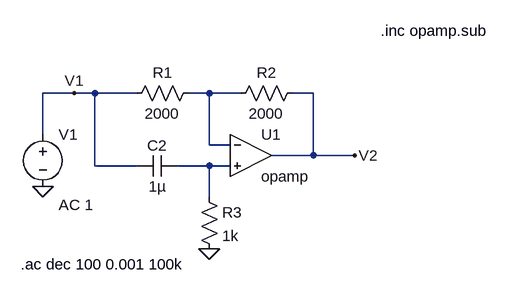
[diagram p0: schematic Circuito LTspice.asc]
Circuito LTspice.asc, the LTspice schematic file:
Version 4
SHEET 1 880 680
WIRE -80 80 -128 80
WIRE -48 80 -80 80
WIRE 16 80 -48 80
WIRE 128 80 96 80
WIRE 176 80 128 80
WIRE 288 80 256 80
WIRE -128 144 -128 80
WIRE 128 160 128 80
WIRE 160 160 128 160
WIRE 288 176 288 80
WIRE 288 176 224 176
WIRE 352 176 288 176
WIRE -48 192 -48 80
WIRE 16 192 -48 192
WIRE 128 192 80 192
WIRE 160 192 128 192
WIRE 128 240 128 192
FLAG 128 320 0
FLAG 352 176 V2
FLAG -80 80 V1
FLAG -128 224 0
SYMBOL OpAmps\\opamp 192 112 R0
SYMATTR InstName U1
SYMBOL res 112 64 R90
WINDOW 0 0 56 VBottom 2
WINDOW 3 32 56 VTop 2
SYMATTR InstName R1
SYMATTR Value 2000
SYMBOL res 272 64 R90
WINDOW 0 0 56 VBottom 2
WINDOW 3 32 56 VTop 2
SYMATTR InstName R2
SYMATTR Value 2000
SYMBOL cap 80 176 R90
WINDOW 0 0 32 VBottom 2
WINDOW 3 32 32 VTop 2
SYMATTR InstName C2
SYMATTR Value 1µ
SYMBOL res 112 224 R0
SYMATTR InstName R3
SYMATTR Value 1k
SYMBOL voltage -128 128 R0
WINDOW 123 24 124 Left 2
WINDOW 39 0 0 Left 0
SYMATTR InstName V1
SYMATTR Value ""
SYMATTR Value2 AC 1
TEXT 392 -16 Left 2 !.inc opamp.sub
TEXT -162 344 Left 2 !.ac dec 100 0.001 100k

The netlist it stands for:
* Circuito LTspice.asc
XU1 N001 N002 V2 opamp Aol=100K GBW=10Meg  ; pins invin noninvin out
R1 N001 V1 2000
R2 V2 N001 2000
C2 N002 V1 1µ
R3 N002 0 1k
V1 V1 0 AC 1
.inc opamp.sub
.ac dec 100 0.001 100k
.backanno
.end